# EAGLE design Sensor_HallArray_Ctrl (EAGLE 9.6.2)
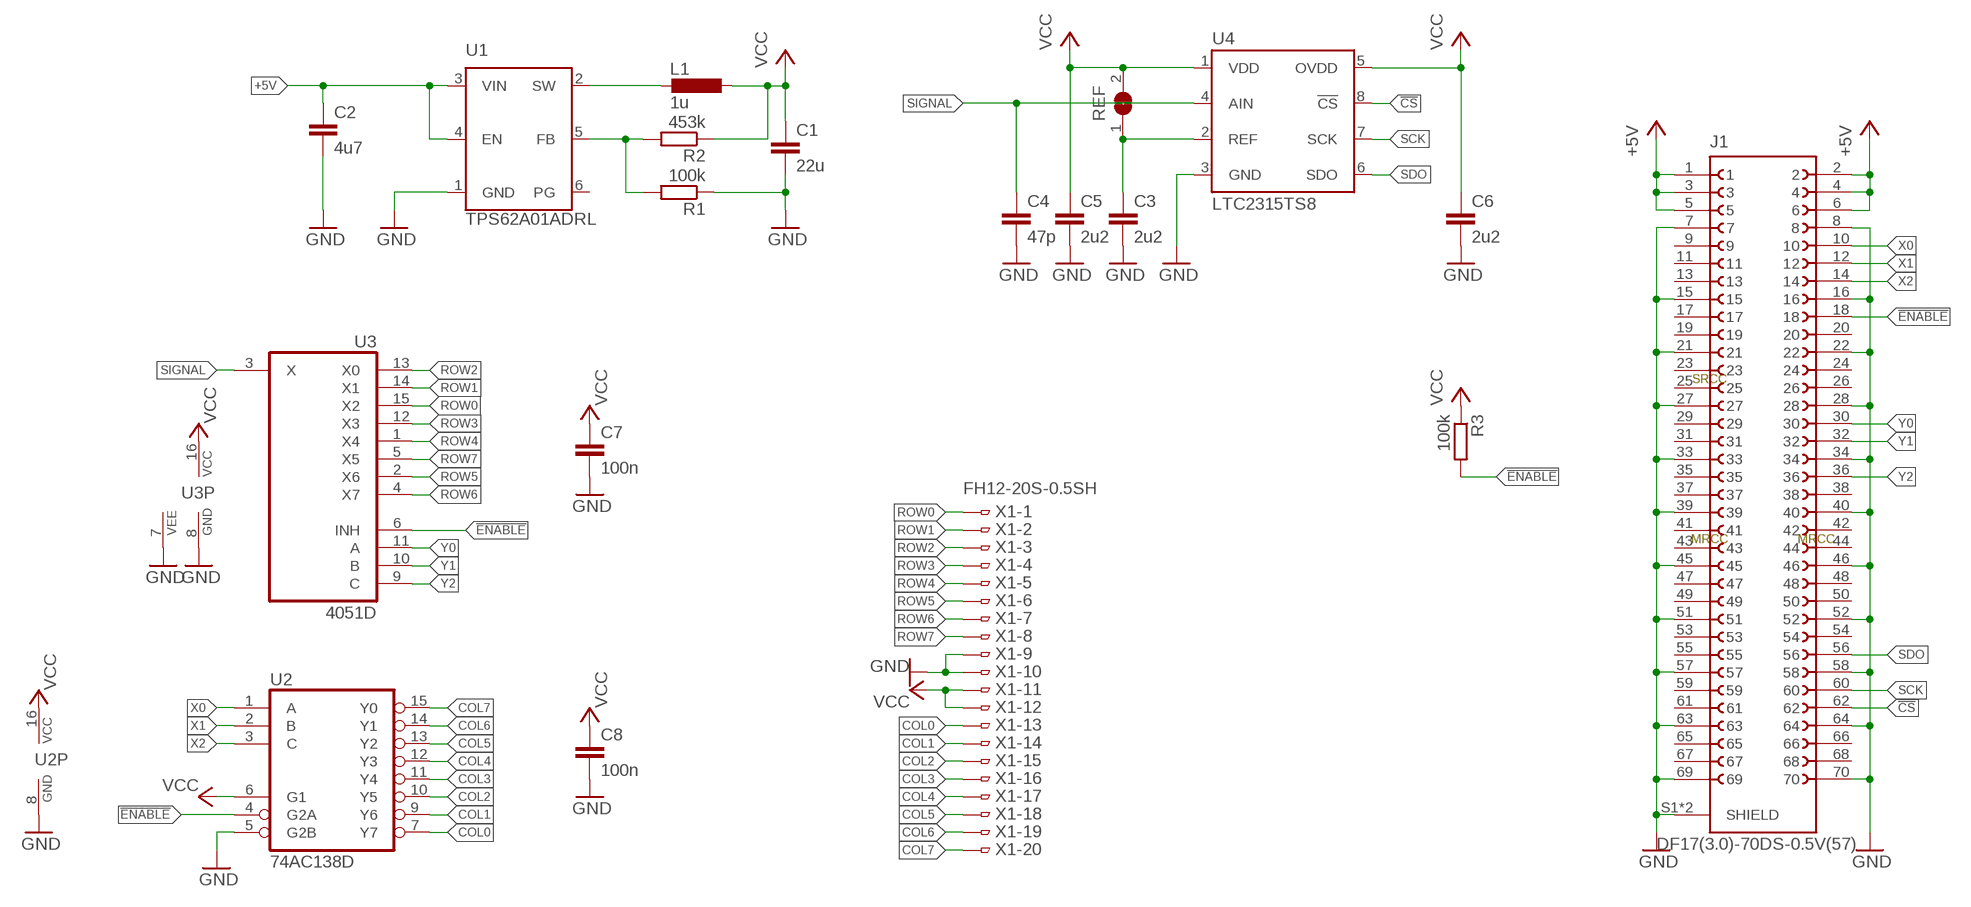
[diagram p0: schematic, sheet 1]

## Parts
C1  22u  C-EUC0603  [C0603]
C2  4u7  C-EUC0603  [C0603]
C3  2u2  C-EUC0603  [C0603]
C4  47p  C-EUC0402  [C0402]
C5  2u2  C-EUC0603  [C0603]
C6  2u2  C-EUC0603  [C0603]
C7  100n  C-EUC0402  [C0402]
C8  100n  C-EUC0402  [C0402]
J1  DF17(3.0)-70DS-0.5V(57)  [DF17(3.0)-70DS-0.5V(57)]
L1  1u  L-EU1008  [L1008]
R1  100k  R-EU_R0402  [R0402]
R2  453k  R-EU_R0402  [R0402]
R3  100k  R-EU_R0402  [R0402]
REF  SJ  [SJ]
U1  TPS62A01ADRL  [SOTFL50P160X60-6N]
U2  74AC138D  [SO16]
U3  4051D  [SO16]
U4  LTC2315TS8  [SOT23-8L]
X1  FH12-20S-0.5SH  [FH12-20S-0.5SH]

## Nets
!CS: J1.62 U4.8(!CS)
!ENABLE: J1.18 R3.2 U2.4(G2A) U3.6(INH)
+5V: C2.1 J1.1 J1.2 J1.3 J1.4 J1.5 J1.6 U1.3(VIN) U1.4(EN)
COL0: U2.7(Y7) X1.13
COL1: U2.9(Y6) X1.14
COL2: U2.10(Y5) X1.15
COL3: U2.11(Y4) X1.16
COL4: U2.12(Y3) X1.17
COL5: U2.13(Y2) X1.18
COL6: U2.14(Y1) X1.19
COL7: U2.15(Y0) X1.20
GND: C1.2 C2.2 C3.2 C4.2 C5.2 C6.2 C7.2 C8.2 J1.7 J1.8 J1.15 J1.16 J1.21 J1.22 J1.27 J1.28 J1.33 J1.34 J1.39 J1.40 J1.45 J1.46 J1.51 J1.52 J1.57 J1.58 J1.63 J1.64 J1.69 J1.70 J1.S1(SHIELD) J1.S2(SHIELD) R1.1 U1.1(GND) U2.5(G2B) U2.8(GND) U3.7(VEE) U3.8(GND) U4.3(GND) X1.9 X1.10
N$00044: R1.2 R2.2 U1.5(FB)
N$50: L1.2 U1.2(SW)
N$00069: C3.1 REF.1 U4.2(REF)
ROW0: U3.15(X2) X1.1
ROW1: U3.14(X1) X1.2
ROW2: U3.13(X0) X1.3
ROW3: U3.12(X3) X1.4
ROW4: U3.1(X4) X1.5
ROW5: U3.2(X6) X1.6
ROW6: U3.4(X7) X1.7
ROW7: U3.5(X5) X1.8
SCK: J1.60 U4.7(SCK)
SDO: J1.56 U4.6(SDO)
SIGNAL: C4.1 U3.3(X) U4.4(AIN)
VCC: C1.1 C5.1 C6.1 C7.1 C8.1 L1.1 R2.1 R3.1 REF.2 U2.6(G1) U2.16(VCC) U3.16(VCC) U4.1(VDD) U4.5(OVDD) X1.11 X1.12
X0: J1.10 U2.1(A)
X1: J1.12 U2.2(B)
X2: J1.14 U2.3(C)
Y0: J1.30 U3.11(A)
Y1: J1.32 U3.10(B)
Y2: J1.36 U3.9(C)
Unconnected: J1.9 J1.11 J1.13 J1.17 J1.19 J1.20 J1.23 J1.24 J1.25 J1.26 J1.29 J1.31 J1.35 J1.37 J1.38 J1.41 J1.42 J1.43 J1.44 J1.47 J1.48 J1.49 J1.50 J1.53 J1.54 J1.55 J1.59 J1.61 J1.65 J1.66 J1.67 J1.68 U1.6(PG)

## Notes on the sheet
- SRCC
- MRCC | MRCC

## Library data of the parts
C1 = rcl:C-EU: CAPACITOR, European symbol; LCSC: C109448
C2 C3 C5 C6 = rcl:C-EU: CAPACITOR, European symbol; LCSC: C19666
C4 C7 C8 = rcl:C-EU: CAPACITOR, European symbol; SPICEPREFIX: C
J1 = Hirose:DF17(3.0)-70DS-0.5V(57)
L1 = rcl:L-EU: INDUCTOR, European symbol; DIGIKEY: 490-5112-1-ND; LCSC: C86091; MPN: LQM2HPN1R0MG0L
R1 R3 = rcl:R-EU_: RESISTOR, European symbol; DIGIKEY: RMCF0402FT100KCT-ND; LCSC: C60491; SPICEPREFIX: R
R2 = rcl:R-EU_: RESISTOR, European symbol; LCSC: C137978; SPICEPREFIX: R
REF = jumper:SJ: SMD solder JUMPER
U1 = TPS62A01DRLR:TPS62A01ADRL; DESCRIPTION: 2.5V-5.5V input, 1-A high efficiency step-down converter in 2x2 QFN or SOT563 package; DIGIKEY: 296-TPS62A01ADRLRCT-ND; HEIGHT: 0.6mm; LCSC: C5181455; MANUFACTURER_NAME: Texas Instruments; MANUFACTURER_PART_NUMBER: TPS62A01ADRLR; MOUSER: 595-TPS62A01ADRLR
U2 = 74xx-eu:74*138: 3-line to 8-line DECODER/DEMULTIPLEXER
U3 = 40xx:4051: 8-channel ANALOG MULTIPLEXER
U4 = analog_devices:LTC2315: LTC2315 12/14-Bit, 500ksps - 5Msps Serial Sampling ADC
X1 = con-hirose:FH12-20S-0.5S: 0.5mm Pitch Connectors For FPC/FFC Source: Data sheet <http://www.hirose.co.jp/cataloge_hp/e58605370.pdf>; MPN: FH12-20S-0.5SH(55); OC_FARNELL: 1324549; OC_NEWARK: 34M6166

## Board
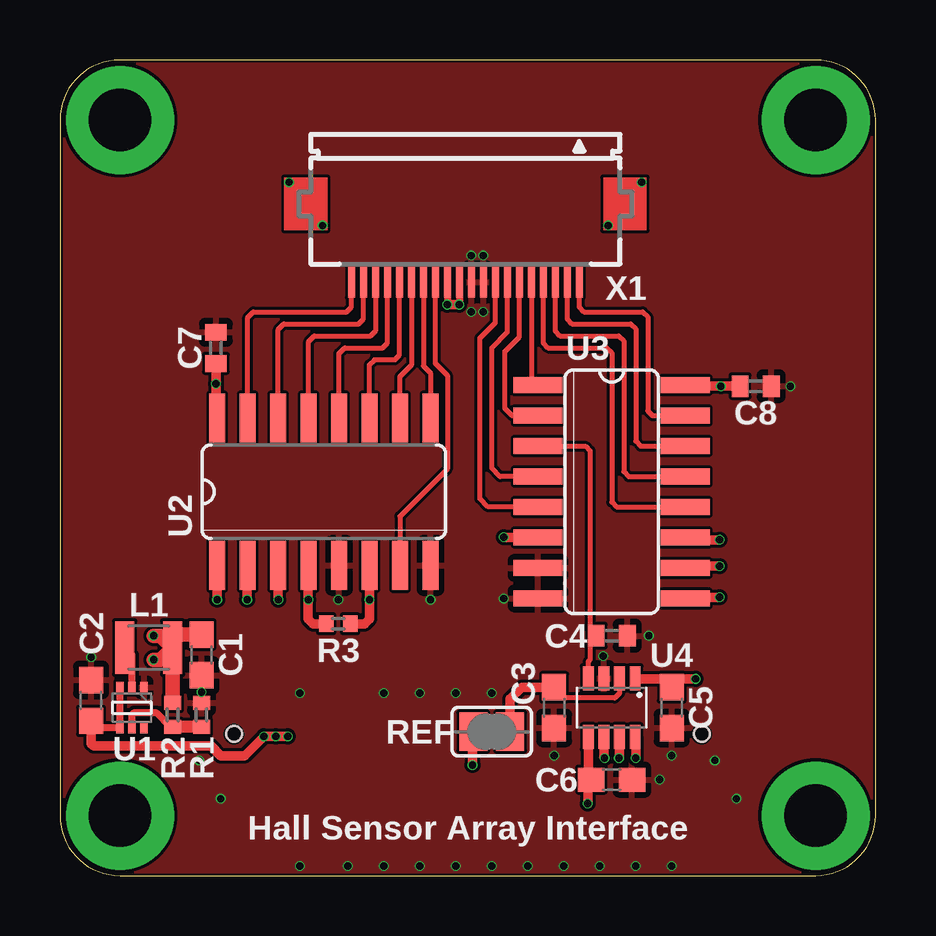
[diagram p1: board, top side]
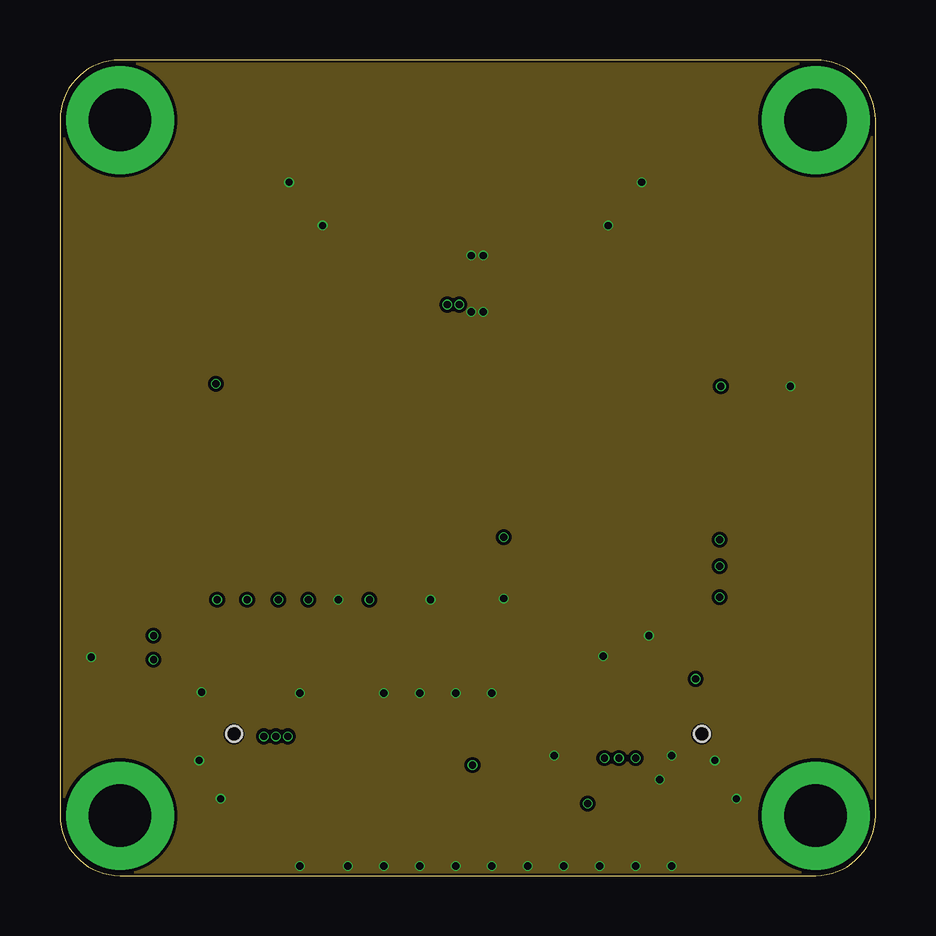
[diagram p2: board, inner layer Route2]
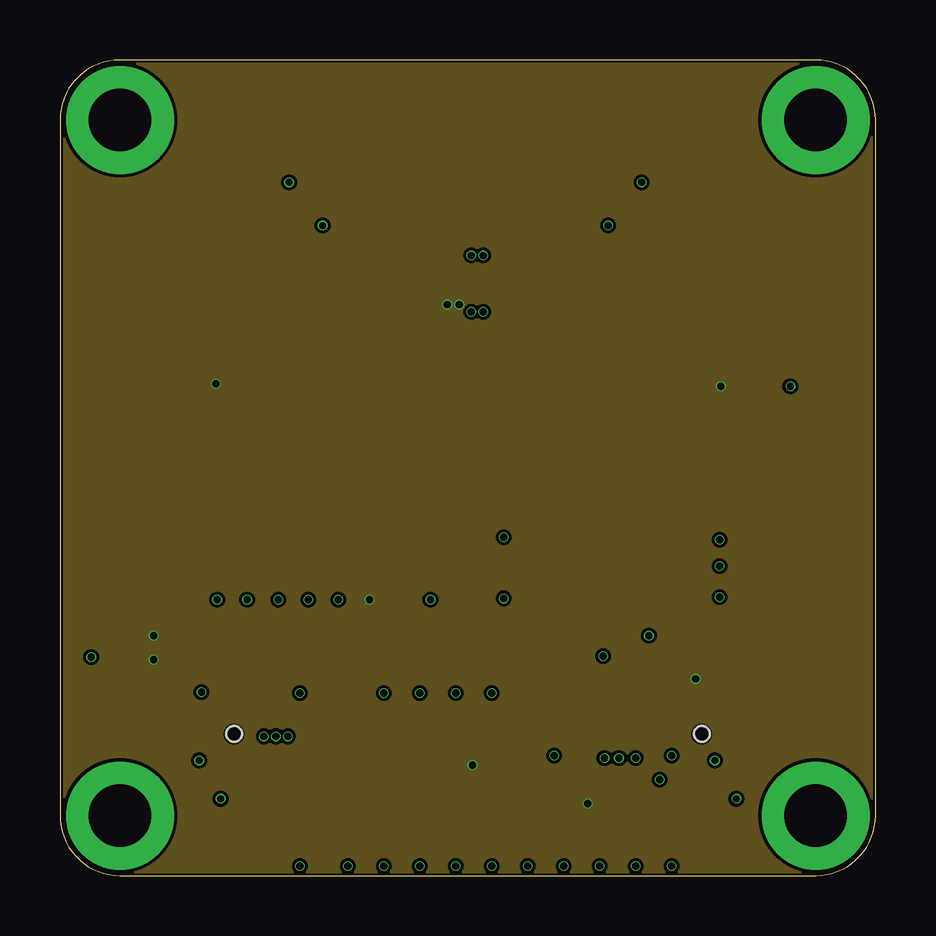
[diagram p3: board, inner layer Route15]
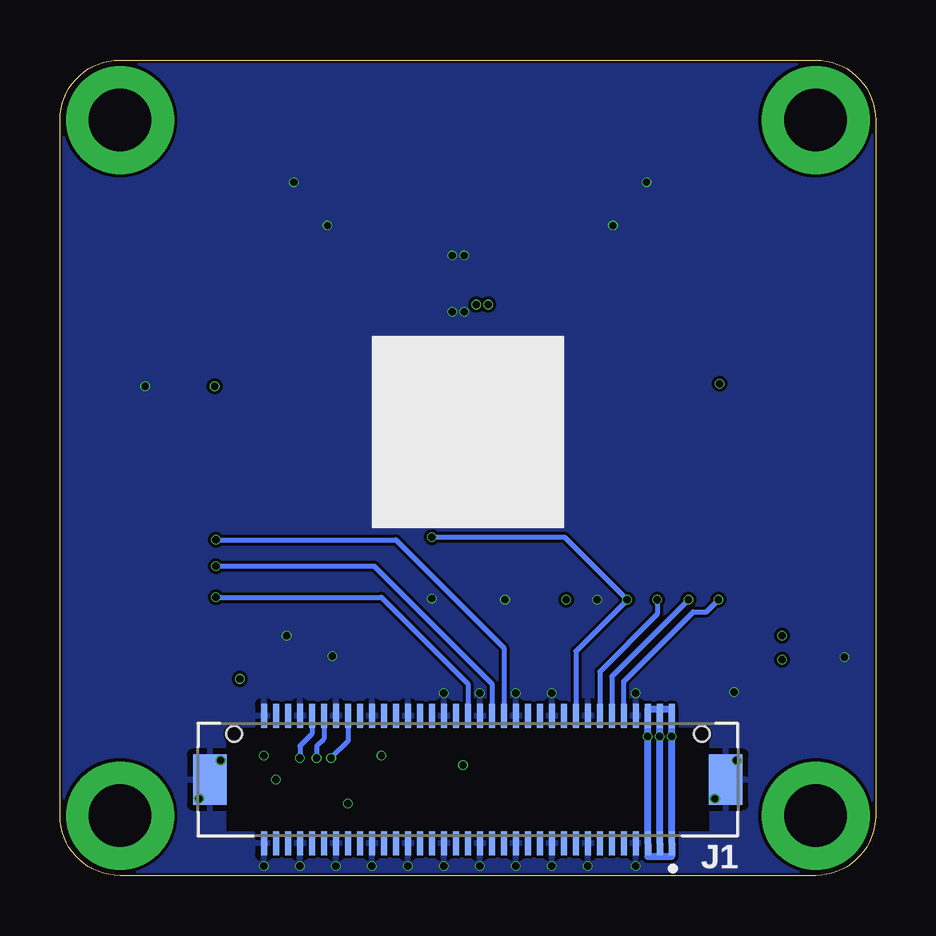
[diagram p4: board, bottom side, seen from below]

Size 34 x 34 mm. Coordinates in mm from the lower left corner, seen from the top.
Outline: 2.5,0 31.5,0 arc90 34,2.5 34,31.5 arc90 31.5,34 2.5,34 arc90 0,31.5 0,2.5 arc90 2.5,0
Copper layers (1*2*15*16): Top 0.035559375mm / dielectric 0.17018125mm / Route2 0.01778125mm / dielectric 47mil / Route15 0.01778125mm / dielectric 0.17018125mm / Bottom 0.035559375mm
Design rules "jlcpcb-4-layer *": minimum track width 5mil, minimum drill 0.2mm, track to track 5mil, track to pad 5mil, pad to pad 5mil, via to via 5mil, smd to smd 0mil, copper to edge 0.1mm, drill to drill 5mil, minimum pad ring 0.1mm, minimum via ring 0.05mm, stop-mask expansion 3mil, vias tented up to drill 100mil, thermal gap 10mil

### Footprints (pad centres in the part's own frame; a part is rotated, then mirrored left to right if it is on the bottom)
C0603 = smd 1.1 x 1: 1 -0.85,0; 2 0.85,0
C0402 = smd 0.7 x 0.9: 1 -0.65,0; 2 0.65,0
DF17(3.0)-70DS-0.5V(57) = smd 0.25 x 1: 1 -8.5,2.65; 2 -8.5,-2.65; 3 -8,2.65; 4 -8,-2.65; 5 -7.5,2.65; 6 -7.5,-2.65; 7 -7,2.65; 8 -7,-2.65; 9 -6.5,2.65; 10 -6.5,-2.65; 11 -6,2.65; 12 -6,-2.65; 13 -5.5,2.65; 14 -5.5,-2.65; 15 -5,2.65; 16 -5,-2.65; 17 -4.5,2.65; 18 -4.5,-2.65; 19 -4,2.65; 20 -4,-2.65; 21 -3.5,2.65; 22 -3.5,-2.65; 23 -3,2.65; 24 -3,-2.65; 25 -2.5,2.65; 26 -2.5,-2.65; 27 -2,2.65; 28 -2,-2.65; 29 -1.5,2.65; 30 -1.5,-2.65; 31 -1,2.65; 32 -1,-2.65; 33 -0.5,2.65; 34 -0.5,-2.65; 35 0,2.65; 36 0,-2.65; 37 0.5,2.65; 38 0.5,-2.65; 39 1,2.65; 40 1,-2.65; 41 1.5,2.65; 42 1.5,-2.65; 43 2,2.65; 44 2,-2.65; 45 2.5,2.65; 46 2.5,-2.65; 47 3,2.65; 48 3,-2.65; 49 3.5,2.65; 50 3.5,-2.65; 51 4,2.65; 52 4,-2.65; 53 4.5,2.65; 54 4.5,-2.65; 55 5,2.65; 56 5,-2.65; 57 5.5,2.65; 58 5.5,-2.65; 59 6,2.65; 60 6,-2.65; 61 6.5,2.65; 62 6.5,-2.65; 63 7,2.65; 64 7,-2.65; 65 7.5,2.65; 66 7.5,-2.65; 67 8,2.65; 68 8,-2.65; 69 8.5,2.65; 70 8.5,-2.65 | smd 1.4 x 2.1: S1 -10.75,0; S2 10.75,0 | hole 0.65: -9.75,-1.9; 9.75,-1.9
L1008 = smd 0.8 x 2.2: 1 -1,0; 2 1,0
R0402 = smd 0.6 x 0.7: 1 -0.5,0; 2 0.5,0
SJ = smd 1.168 x 1.6: 1 -0.762,0; 2 0.762,0
SOTFL50P160X60-6N = smd 0.475 x 0.3: 1 -0.838,0.5; 2 -0.838,0; 3 -0.838,-0.5; 4 0.838,-0.5; 5 0.838,0; 6 0.838,0.5
SO16 = smd 0.66 x 2.032: 1 -4.445,-3.073; 2 -3.175,-3.073; 3 -1.905,-3.073; 4 -0.635,-3.073; 5 0.635,-3.073; 6 1.905,-3.073; 7 3.175,-3.073; 8 4.445,-3.073; 9 4.445,3.073; 10 3.175,3.073; 11 1.905,3.073; 12 0.635,3.073; 13 -0.635,3.073; 14 -1.905,3.073; 15 -3.175,3.073; 16 -4.445,3.073
SOT23-8L = smd 0.45 x 1: 1 -0.975,-1.225; 2 -0.325,-1.225; 3 0.325,-1.225; 4 0.975,-1.225; 5 0.975,1.225; 6 0.325,1.225; 7 -0.325,1.225; 8 -0.975,1.225
FH12-20S-0.5SH = smd 0.3 x 1.3: 1 -4.75,3.25; 2 -4.25,3.25; 3 -3.75,3.25; 4 -3.25,3.25; 5 -2.75,3.25; 6 -2.25,3.25; 7 -1.75,3.25; 8 -1.25,3.25; 9 -0.75,3.25; 10 -0.25,3.25; 11 0.25,3.25; 12 0.75,3.25; 13 1.25,3.25; 14 1.75,3.25; 15 2.25,3.25; 16 2.75,3.25; 17 3.25,3.25; 18 3.75,3.25; 19 4.25,3.25; 20 4.75,3.25

### Placement (x,y rotation side)
C1  5.9,9.2 270 top
C2  1.3,7.3 90 top
C3  20.6,7 270 top
C4  23,10 0 top
C5  25.5,7 270 top
C6  23,4 0 top
C7  6.5,22 90 top
C8  29,20.4 0 top
J1  17,4 180 bottom
L1  3.7,9.5 180 top
R1  5.9,6.7 270 top
R2  4.7,6.7 270 top
R3  11.6,10.5 180 top
REF  18,6 180 top
U1  3,7 270 top
U2  11,16 0 top
U3  23,16 270 top
U4  23,7 180 top
X1  16.9,28 180 top

### Tracks (layer width: path | path; a pad name or v marks a point on that pad's centre or on a via)
!CS  (via drill 0.3)
  Top 0.4: U4.8 24,5.75 v24,4.9
  Bottom 0.2: J1.62 23.5,5.9 24,5.4 v24,4.9
!ENABLE  (via drill 0.3)
  Top 0.2: U3.6
  Top 0.4: U3.6 v18.5,14.1 | U2.4 10.35,12.91 v10.35,11.5 10.35,10.7 10.55,10.5 R3.2
  Bottom 0.2: v18.5,14.1 12.95,14.1 v10.35,11.5 12.5,9.35 J1.18
+5V  (via drill 0.3)
  Top 0.2: 1.1,6.1 1.3,6.3 1.38,6.38
  Top 0.3: C2.1 1.38,6.38 1.59,6.16 U1.4 U1.3
  Top 0.4: C2.1 1.5,6.25 | v9.5,5.8 v9,5.8 v8.5,5.8 7.7,5 6.7,5 6.3,5.4 1.4,5.4 1.3,5.5 1.3,6.3
  Bottom 0.3: 9,6.95 9.5,6.95 J1.6 v9.5,5.8 J1.5 9.5,0.8 9,0.8 | 9,6.95 8.5,6.95 J1.2 v8.5,5.8 J1.1 8.5,0.8 9,0.8 | 9,6.95 J1.4 v9,5.8 J1.3 9,0.8
COL0
  Top 0.2: X1.13 15.65,21.35 16.15,20.85 16.15,16.95 14.18,14.97 U2.7
COL1
  Top 0.2: X1.14 15.15,21.25 15.45,20.95 U2.9
COL2
  Top 0.2: X1.15 14.65,21.27 14.18,20.8 U2.10
COL3
  Top 0.2: X1.16 14.15,21.7 13.95,21.5 13.11,21.5 12.91,21.3 U2.11
COL4
  Top 0.2: X1.17 13.65,22.2 13.45,22 11.87,22 11.63,21.77 U2.12
COL5
  Top 0.2: X1.18 13.15,22.7 12.95,22.5 10.59,22.5 10.37,22.27 U2.13
COL6
  Top 0.2: X1.19 12.65,23.2 12.45,23 9.32,23 9.09,22.77 U2.14
COL7
  Top 0.2: X1.20 12.15,23.7 11.95,23.5 8.05,23.5 7.82,23.27 U2.15
GND  (via drill 0.3)
  other vias: 15,0.4 16.5,0.4 18,0.4 19.5,0.4 21,0.4 22.5,0.4 24,0.4 5.8,4.8 6.7,3.2 27.3,4.8 28.2,3.2 10,0.4 12,0.4 13.5,0.4 25.5,0.4 11.6,11.5 18.5,11.55 22.65,9.15 25,4 25.5,5 20.6,5 16.5,7.6 18,7.6 15,7.6 13.5,7.6 10,7.6 1.3,9.1 5.9,7.65 17.15,25.85 17.15,23.5 9.55,28.9 10.95,27.1 22.85,27.1 24.25,28.9 17.65,23.5 17.65,25.85 30.45,20.4 24.55,10 15.45,11.5
  pour Top: 0,0 34,0 34,34 0,34
  pour Bottom: 0,0 34,0 34,34 0,34
  pour Route2: 0,0 34,0 34,34 0,34
N$00001  (via drill 2.6 pad 4.5)
  other vias: 2.5,31.5
N$00002  (via drill 2.6 pad 4.5)
  other vias: 31.5,31.5
N$00027  (via drill 2.6 pad 4.5)
  other vias: 2.5,2.5
N$00028  (via drill 2.6 pad 4.5)
  other vias: 31.5,2.5
N$00044
  Top 0.3: U1.5 3,6.7 3.1,6.8 4,6.8 4.6,6.2 R2.2
  Top 0.5: R1.2 R2.2
N$50
  Top 0.2: 3,9.2 L1.2
  Top 0.3: U1.2 3,9.2
N$00069
  Top 0.2: U4.2 23.32,7.6 23.12,7.4 21.05,7.4 C3.1
  Top 0.4: REF.1 18.76,7.36 19.25,7.85 C3.1
ROW0
  Top 0.2: U3.15 24.7,19.18 24.5,19.38 24.5,23.3 24.3,23.5 21.85,23.5 21.65,23.7 X1.1
ROW1
  Top 0.2: U3.14 24.2,17.91 24,18.11 24,22.8 23.8,23 21.35,23 21.15,23.2 X1.2
ROW2
  Top 0.2: U3.13 23.7,16.64 23.5,16.84 23.5,22.3 23.3,22.5 20.85,22.5 20.65,22.7 X1.3
ROW3
  Top 0.2: U3.12 23.2,15.37 23,15.56 23,21.8 22.8,22 20.35,22 20.15,22.2 X1.4
ROW4
  Top 0.2: 19.15,20.45 19.7,20.45 | 19.7,20.45 U3.1 | X1.5 19.65,20.5 19.7,20.45
ROW5
  Top 0.2: U3.2 18.85,19.18 18.55,19.48 18.55,21.85 19.15,22.45 X1.6
ROW6
  Top 0.2: U3.4 18.35,16.64 18,16.98 18,22 18.65,22.65 X1.7
ROW7
  Top 0.2: U3.5 17.85,15.37 17.5,15.71 17.5,22.4 18.15,23.05 X1.8
SCK  (via drill 0.3)
  Top 0.4: U4.7 23.32,4.93 v23.3,4.9
  Bottom 0.2: J1.60 23,5.7 23.3,5.4 v23.3,4.9
SDO  (via drill 0.3)
  Top 0.4: U4.6 22.68,4.93 v22.7,4.9
  Bottom 0.2: J1.56 22,5.6 v22.7,4.9
SIGNAL
  Top 0.2: U3.3 21.9,17.91 22.1,17.7 22.1,10.25 C4.1 22.1,9.75 22.1,9 22.02,8.93 U4.4
VCC  (via drill 0.3)
  Top 0.3: X1.11 v16.65,23.8 | X1.12 v16.15,23.8
  Top 0.4: U3.16 26.12,20.4 v27.55,20.4 C8.1 | U4.1 24,8.2 25.15,8.2 C5.1 25.85,8.2 v26.5,8.2 | U4.5 22.02,4.12 C6.1 22,3.85 v22,3 | C7.1 v6.5,20.5 6.5,19.13 U2.16 | v16.65,23.8 v16.15,23.8 | U2.6 v12.9,11.5 12.9,10.7 12.7,10.5 R3.1 | v17.2,4.6 17.2,5.96 REF.2
  Top 0.5: 4.75,10.05 4.7,10.1 L1.1
  Top 0.6: L1.1 R2.1 | C1.1 4.75,10.05 | L1.1 4.2,10 v3.9,10 | L1.1 4.2,9 v3.9,9
  pour Route15: 0,0 34,0 34,34 0,34
X0  (via drill 0.3)
  Top 0.4: v6.55,11.5 U2.1
  Bottom 0.2: J1.10 10.5,8.1 7.6,11 7.05,11 v6.55,11.5
X1  (via drill 0.3)
  Top 0.4: v7.8,11.5 7.8,12.9 U2.2
  Bottom 0.2: v7.8,11.5 11,8.3 J1.12
X2  (via drill 0.3)
  Top 0.4: v9.1,11.5 U2.3
  Bottom 0.2: v9.1,11.5 9.1,10.9 11.5,8.5 J1.14
Y0  (via drill 0.3)
  Top 0.2: U3.11 26.17,14
  Top 0.4: 26.17,14 v27.5,14
  Bottom 0.2: v27.5,14 20,14 15.5,9.5 J1.30
Y1  (via drill 0.3)
  Top 0.2: U3.10 26.15,12.9
  Top 0.4: 26.15,12.9 v27.5,12.9
  Bottom 0.2: v27.5,12.9 20.9,12.9 16,8 J1.32
Y2  (via drill 0.3)
  Top 0.2: U3.9 26.12,11.6
  Top 0.4: 26.12,11.6 v27.5,11.6
  Bottom 0.2: v27.5,11.6 20.6,11.6 17,8 J1.36

### Text on the board
tNames: Hall Sensor Array Interface